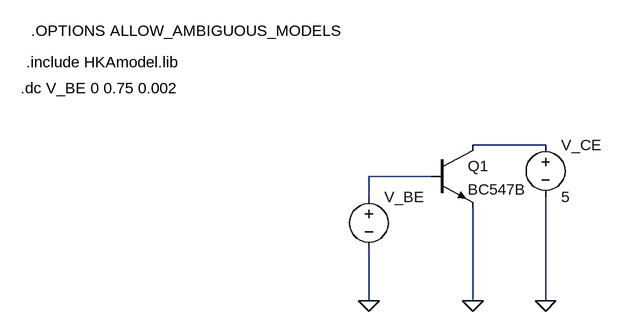
[diagram p0: schematic 1.asc]
1.asc, the LTspice schematic file:
Version 4.1
SHEET 1 880 680
WIRE 112 16 0 16
WIRE -64 64 -160 64
WIRE -160 96 -160 64
WIRE -160 256 -160 176
WIRE 0 256 0 112
WIRE 112 256 112 96
FLAG 0 256 0
FLAG -160 256 0
FLAG 112 256 0
SYMBOL voltage -160 80 R0
SYMATTR InstName V_BE
SYMATTR Value ""
SYMBOL voltage 112 0 R0
WINDOW 123 0 0 Left 0
WINDOW 39 0 0 Left 0
SYMATTR InstName V_CE
SYMATTR Value 5
SYMBOL npn -64 16 R0
SYMATTR InstName Q1
SYMATTR Value BC547B
TEXT -696 -72 Left 2 !.dc V_BE 0 0.75 0.002
TEXT -688 -112 Left 2 !.include HKAmodel.lib
TEXT -680 -160 Left 2 !.OPTIONS ALLOW_AMBIGUOUS_MODELS

The netlist it stands for:
* 1.asc
V_BE N002 0
V_CE N001 0 5
Q1 N001 N002 0 0 BC547B
.model NPN NPN
.model PNP PNP
.lib standard.bjt
.dc V_BE 0 0.75 0.002
.include HKAmodel.lib
.OPTIONS ALLOW_AMBIGUOUS_MODELS
.backanno
.end

* Results of the author's LTspice run, read from the files saved beside the schematic
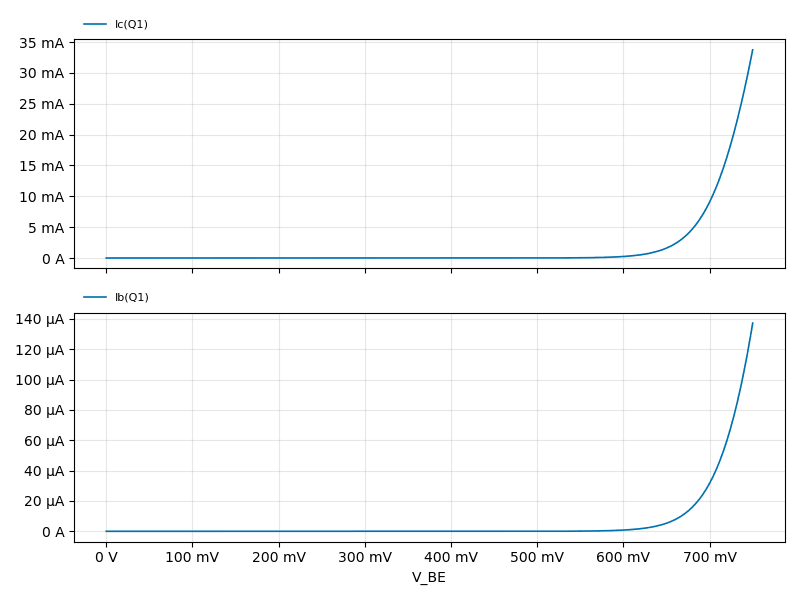
[diagram p1: DC transfer characteristic of 1.asc, plotted from the saved traces]
* DC transfer characteristic, 1 run:
*   Ic(Q1): 5.091 pA at V_BE=0 V, 33.74 mA at V_BE=750 mV, min 5.091 pA, max 33.74 mA
*   Ib(Q1): -5.066 pA at V_BE=0 V, 137.2 µA at V_BE=750 mV, min -5.066 pA, max 137.2 µA